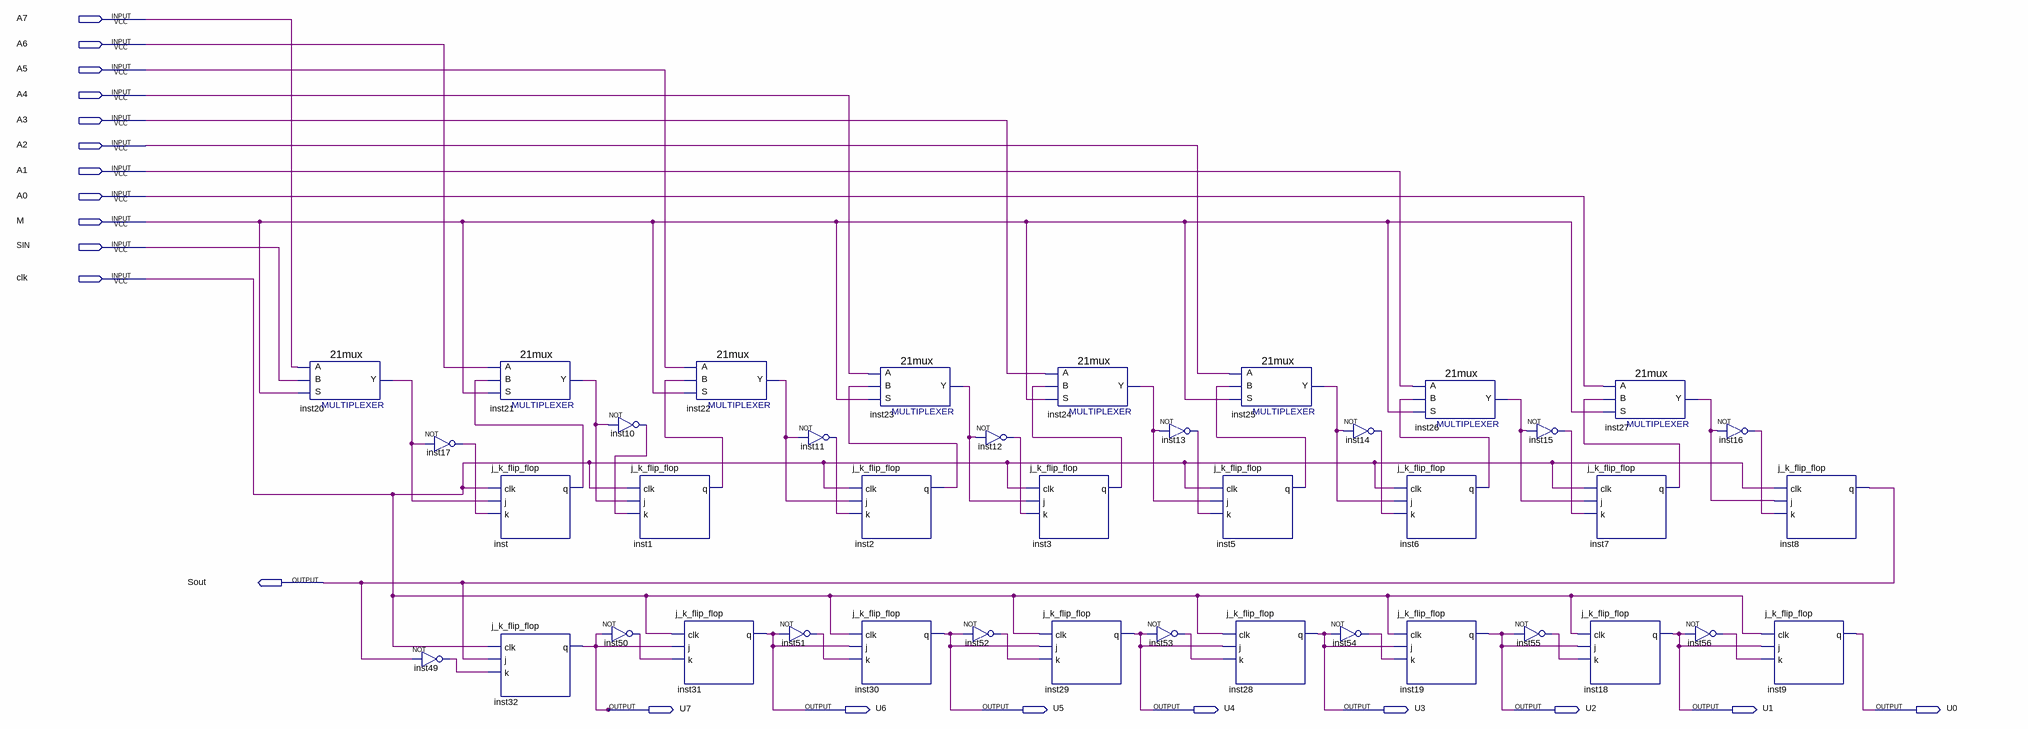
[diagram p0: schematic sheet]
// Quartus schematic lab3uppgift2.bdf as structural Verilog: 40 symbols, 20 pins
module lab3uppgift2 (
  input  A7,
  input  A6,
  input  A5,
  input  A4,
  input  A3,
  input  A2,
  input  A1,
  input  A0,
  input  M,
  input  SIN,
  input  clk,
  output Sout,
  output U7,
  output U6,
  output U5,
  output U4,
  output U3,
  output U2,
  output U1,
  output U0
);

  wire inst1_q, inst2_q, inst3_q, inst5_q, inst6_q, inst7_q, inst10_out, inst11_out, inst12_out, inst13_out,
       inst14_out, inst15_out, inst16_out, inst17_out, inst20_y, inst21_y, inst22_y, inst23_y, inst24_y,
       inst25_y, inst26_y, inst27_y, inst49_out, inst50_out, inst51_out, inst52_out, inst53_out, inst54_out,
       inst55_out, inst56_out, inst_q;

  \21mux  inst20 (.S(M), .B(SIN), .A(A7), .Y(inst20_y));
  not inst49 (inst49_out, Sout);
  not inst17 (inst17_out, inst20_y);
  \21mux  inst21 (.S(M), .B(inst_q), .A(A6), .Y(inst21_y));
  j_k_flip_flop inst (.clk(clk), .j(inst20_y), .k(inst17_out), .q(inst_q));
  j_k_flip_flop inst32 (.clk(clk), .j(Sout), .k(inst49_out), .q(U7));
  not inst10 (inst10_out, inst21_y);
  not inst50 (inst50_out, U7);
  j_k_flip_flop inst1 (.clk(clk), .j(inst21_y), .k(inst10_out), .q(inst1_q));
  \21mux  inst22 (.S(M), .B(inst1_q), .A(A5), .Y(inst22_y));
  j_k_flip_flop inst31 (.clk(clk), .j(U7), .k(inst50_out), .q(U6));
  not inst11 (inst11_out, inst22_y);
  not inst51 (inst51_out, U6);
  \21mux  inst23 (.S(M), .B(inst2_q), .A(A4), .Y(inst23_y));
  j_k_flip_flop inst2 (.clk(clk), .j(inst22_y), .k(inst11_out), .q(inst2_q));
  j_k_flip_flop inst30 (.clk(clk), .j(U6), .k(inst51_out), .q(U5));
  not inst52 (inst52_out, U5);
  not inst12 (inst12_out, inst23_y);
  \21mux  inst24 (.S(M), .B(inst3_q), .A(A3), .Y(inst24_y));
  j_k_flip_flop inst3 (.clk(clk), .j(inst23_y), .k(inst12_out), .q(inst3_q));
  j_k_flip_flop inst29 (.clk(clk), .j(U5), .k(inst52_out), .q(U4));
  not inst13 (inst13_out, inst24_y);
  not inst53 (inst53_out, U4);
  j_k_flip_flop inst5 (.clk(clk), .j(inst24_y), .k(inst13_out), .q(inst5_q));
  j_k_flip_flop inst28 (.clk(clk), .j(U4), .k(inst53_out), .q(U3));
  \21mux  inst25 (.S(M), .B(inst5_q), .A(A2), .Y(inst25_y));
  not inst14 (inst14_out, inst25_y);
  not inst54 (inst54_out, U3);
  \21mux  inst26 (.S(M), .B(inst6_q), .A(A1), .Y(inst26_y));
  j_k_flip_flop inst6 (.clk(clk), .j(inst25_y), .k(inst14_out), .q(inst6_q));
  j_k_flip_flop inst19 (.clk(clk), .j(U3), .k(inst54_out), .q(U2));
  not inst15 (inst15_out, inst26_y);
  not inst55 (inst55_out, U2);
  j_k_flip_flop inst18 (.clk(clk), .j(U2), .k(inst55_out), .q(U1));
  \21mux  inst27 (.S(M), .B(inst7_q), .A(A0), .Y(inst27_y));
  j_k_flip_flop inst7 (.clk(clk), .j(inst26_y), .k(inst15_out), .q(inst7_q));
  not inst16 (inst16_out, inst27_y);
  not inst56 (inst56_out, U1);
  j_k_flip_flop inst8 (.clk(clk), .j(inst27_y), .k(inst16_out), .q(Sout));
  j_k_flip_flop inst9 (.clk(clk), .j(U1), .k(inst56_out), .q(U0));
endmodule
